# Altium project CurrentSensorV1.PrjPcb
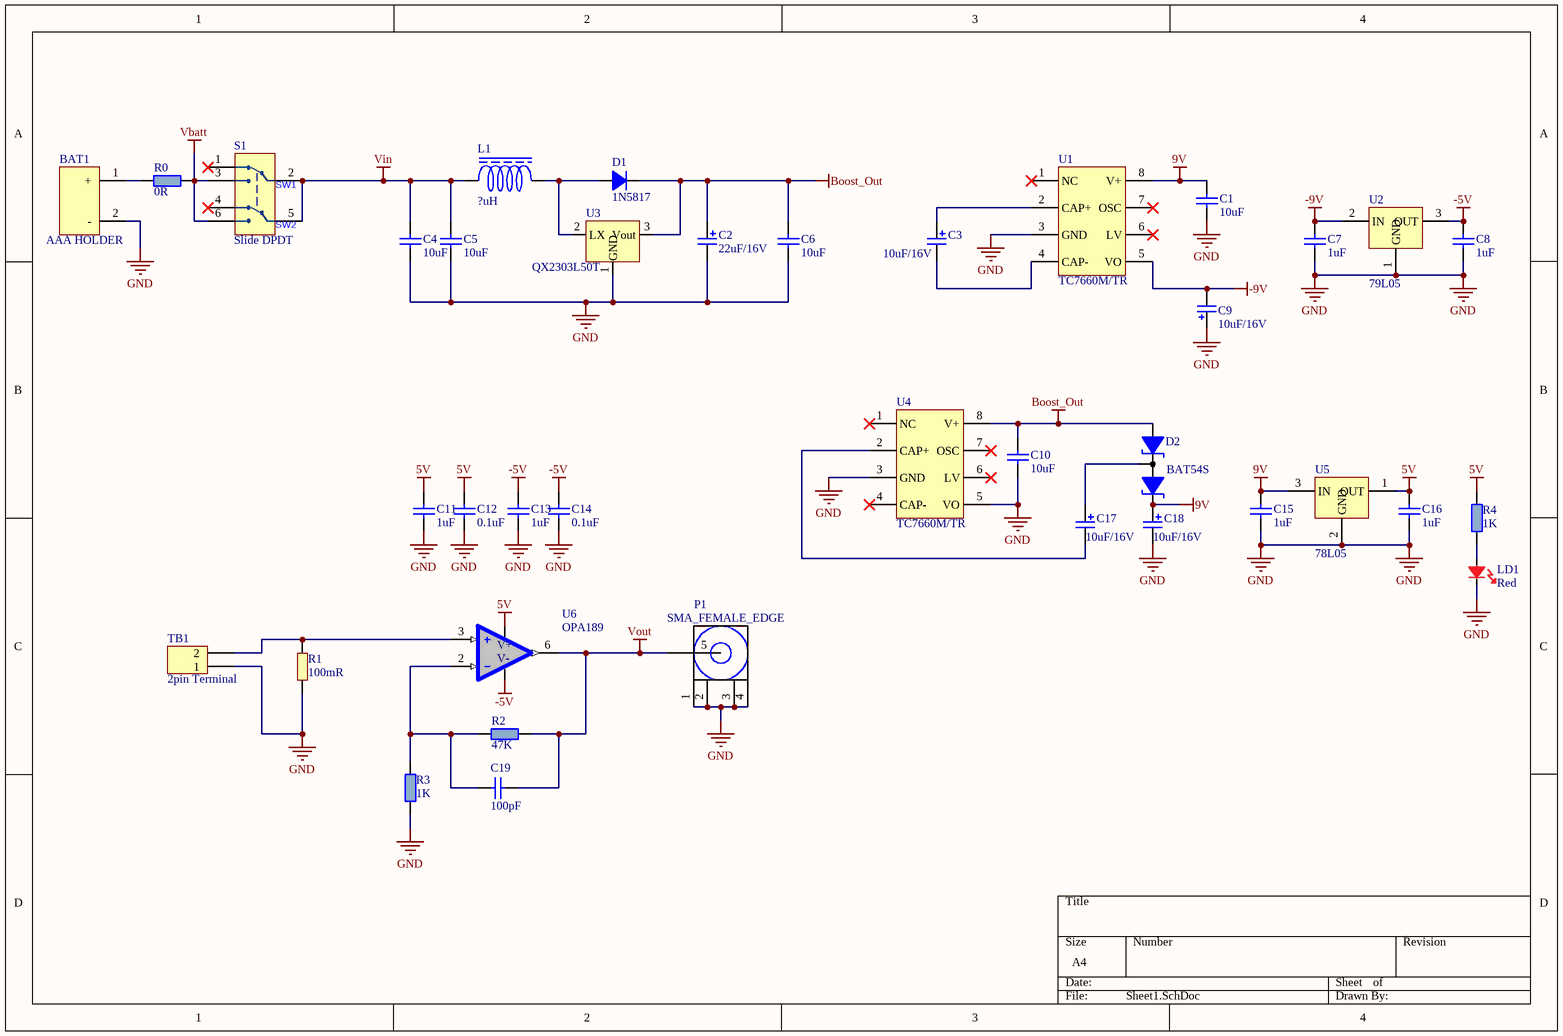
[diagram p0: Sheet1.SchDoc]
1 sheet, 38 parts. Net scope: global (net labels, ports and power ports of the same name join across sheets).
Board file: PCB1.PcbDoc

## Sheet Sheet1.SchDoc
size A4

### Parts
BAT1  AAA HOLDER  [AAA Battery Holder]
C1  10uF  [0805_CAP]
C2  22uF/16V  [CASEB_EIA3528-21]
C3  10uF/16V  [CASEA_EIA3216-18]
C4  10uF  [0805_CAP]
C5  10uF  [0805_CAP]
C6  10uF  [0805_CAP]
C7  1uF  [0805_CAP]
C8  1uF  [0805_CAP]
C9  10uF/16V  [CASEA_EIA3216-18]
C10  10uF  [0805_CAP]
C11  1uF  [0805_CAP]
C12  0.1uF  [0805_CAP]
C13  1uF  [0805_CAP]
C14  0.1uF  [0805_CAP]
C15  1uF  [0805_CAP]
C16  1uF  [0805_CAP]
C17  10uF/16V  [CASEA_EIA3216-18]
C18  10uF/16V  [CASEA_EIA3216-18]
C19  100pF  [0805_CAP]
D1  1N5817  [SOD123]
D2  BAT54S  [SOT23]
L1  ?uH  [IND_40x45x3.2]
LD1  Red  [LED0805_Red]
P1  SMA_FEMALE_EDGE  [SMA_EDGE_CONNECTOR]
R0  0R  [0805_res]
R1  100mR  [2512-1.8]
R2  47K  [0805_res]
R3  1K  [0805_res]
R4  1K  [0805_res]
S1  Slide DPDT  [SW_DPDT_SMD]
TB1  2pin Terminal  [TB_SCW_5mm_2way_Horz_TE101]
U1  TC7660M/TR  [SO8]
U2  79L05  [SOT89]
U3  QX2303L50T  [SOT23]
U4  TC7660M/TR  [SO8]
U5  78L05  [SOT89]
U6  OPA189  [SO8]

### Nets
5V: C11.2 C12.2 C16.2 R4.2 U5.1(OUT) U6.7(V+)
9V: C1.2 C15.2 C18.1(A) D2.2(K2) U1.8(V+) U5.3(IN)
-5V: C8.2 C13.2 C14.2 U2.3(OUT) U6.4(V-)
-9V: C7.2 C9.2(K) U1.5(VO) U2.2(IN)
Boost_Out: C2.1(A) C6.2 C10.2 D1.2(K) D2.1(A1) U3.3(Vout) U4.8(V+)
GND: BAT1.2(-) C1.1 C2.2(K) C4.1 C5.1 C6.1 C7.1 C8.1 C9.1(A) C10.1 C11.1 C12.1 C13.1 C14.1 C15.1 C16.1 C18.2(K) LD1.2(K) P1.1 P1.2 P1.3 P1.4 R1.1 R3.1 TB1.1 U1.3(GND) U2.1(GND) U3.1(GND) U4.3(GND) U4.5(VO) U5.2(GND)
Vbatt: R0.1 S1.3(NO1) S1.6(NO2)
Vin: C4.2 C5.2 L1.1 S1.2(C1) S1.5(C2)
Vout: C19.1 P1.5 R2.2 U6.6(OUT)
NetBAT1_1: BAT1.1(+) R0.2
NetC3_1: C3.1(A) U1.2(CAP+)
NetC3_2: C3.2(K) U1.4(CAP-)
NetC17_1: C17.1(A) D2.3(S)
NetC17_2: C17.2(K) U4.2(CAP+)
NetC19_2: C19.2 R2.1 R3.2 U6.2(IN-)
NetD1_1: D1.1(A) L1.2 U3.2(LX)
NetLD1_1: LD1.1(A) R4.1
NetR1_2: R1.2 TB1.2 U6.3(IN+)

Not connected (* = marked no-connect by the designer): S1 1(NC1)* 4(NC2)*; U1 1(NC)* 6(LV)* 7(OSC)*; U4 1(NC)* 4(CAP-)* 6(LV)* 7(OSC)*

### Notes on the sheet
- (in symbol SW_Slide_DPDT) SW1; SW2

### Library data of the parts
BAT1 = BATT_HOLDER_AAA: LCSC#: C5290189 / Mfr.#: BH-AAA-A1AJ001 / Mfr: MYOUNG / Battery case No 7 - Battery Connectors ROHS
C1 C4-C8 C10-C16 C19 = CC_?F_0805: Capacitor, Ceramic,, ?F, ?V, 0805; Manufacturer: Murata; Notes: Capacitor, Ceramic, 2.2uF, 16V, Y5V, 0805; Mfg_PN: GRM21BF51C225ZA01L; Engineer’s Name: WZ; Category: Cap - Ceramic; Supplier 2: RS Components; Supplier Part Number 2: 312-3156; Date Updated: 1 July 2014; Verified: Correct desc from 50v to 16v
C2 = CT_22uF_16V_3528: / LCSC#: C122226 / Mfr.#: CA45-B016K226T / Mfr: Hunan Xiangyee in S&T / 22uF 16V 2.2Ω@100kHz ±10% CASE-B-3528 Tantalum Capacitors ROHS
C3 C9 C17 C18 = CT_10uF_16V_3216: LCSC#: C119051 / Mfr.#: CA45-A016K106T / Mfr: Hunan Xiangyee in S&T / 10uF 16V 3Ω@100kHz ±10% CASE-A-3216 Tantalum Capacitors ROHS
D1 = DI_1N5817: LCSC#: C5185908 / Mfr.#: 1N5817W / Mfr: Slkor(SLKORMICRO Elec.) / SOD-123 Schottky Barrier Diodes (SBD) ROHS
D2 = DI_BAT54S: LCSC#: C2762214 / Mfr.#: BAT54S / Mfr: Shandong Jingdao Microelectronics / 30V Dual 1V@100mA 0.2A SOT-23 Schottky Barrier Diodes (SBD) ROHS
L1 = IND_?uH_4045: LCSC#: C2929422 / Mfr.#: CY43-47UH / Mfr: SHOU HAN / 400mA 47uH ±10% 525mΩ SMD,4x4.5mm Inductors (SMD) ROHS
LD1 = LED_RED230mcd_2013: LED, Red, 2.0V, Imax 30mA, 120deg. At 20mA => Wavelength = 630nm, 230mcd, 0805; Manufacturer: Kingbright; Mfg_PN: KPT-2012SURCK; Used_for: Alarm; Category: Diode - LED; URL: http://www.farnell.com/datasheets/1753997.pdf; Supplier 2: Farnell; Supplier Part Number 2: 2099241
P1 = CONN_SMA_RF_EDGE: SMA FEMALE Edge Connector
R0 R2-R4 = RS_?R_0805: Resistor, ?ohm, 0805; Manufacturer: MULTICOMP; Notes: Resistor, 10k 100mW 1%, 0805; Mfg_PN: MC0.1W08051%10KFR; Category: Resistor; Supplier 2: Element14; Supplier Part Number 2: 2129195; Supplier 3: Digikey; Supplier Part Number 3: 311-10.0KCRCT-ND
R1 = RS_?R_2512: 2512 Resistor
S1 = SW_Slide_DPDT: LCSC#: C2906280 / Mfr.#: MST22D18G2 125 / Mfr: SHOU HAN / Brick nogging 0.1A DPDT 12V Black 10000次 SMD Slide Switches ROHS
TB1 = TE101_2W_5mm: Screw Terminal Block 5mm Pitch 2 Position, Green; Manufacturer: Dinkle; Notes: Replacable with Altronics P2034A; Mfg_PN: EK500V-02P; Supplier 1: Brooks; Category: Connector; Supplier Part Number 1: TE101; Supplier 2: Element 14; Supplier Part Number 2: 2293859; Supplier 4: ALTRONICS; Supplier Part Number 4: P 2034A; Supplier Part Number 3: 277-1258-ND; Supplier 3: Digikey
U1 U4 = IC_TC7660M/TR: LCSC#: C512761 / Mfr.#: TC7660M/TR / Mfr: HGSEMI / SOP-8 Charge Pump
U2 = LDO_79L05: LCSC#: C7543011 / Mfr.#: 79L05 / Mfr: HXY MOSFET / 100mA null 5V Negative 35V SOT-89 Linear Voltage Regulators (LDO) ROHS
U3 = IC_PMIC_SW_QX2303L50T: LCSC#: C219027 / Mfr.#: QX2303L50T / Mfr: QX Micro Devices / boost converterType 5V 0.7V~5V 800mA SOT-23 DC-DC Converters ROHS
U5 = LDO_78L05: LCSC#: C2891830 / Mfr.#: 78L05 / Mfr: YONGYUTAI / 49dB@(120Hz) 0.1A Fixed 5V Positive 35V SOT-89-3 Linear Voltage Regulators (LDO) ROHS
U6 = IC_OP_OPA189IDR: LCSC#: C781811 / Mfr.#: OPA189IDR / Mfr: Texas Instruments / 14MHz 0.4uV 70pA Single 轨到轨 SOP-8 Precision OpAmps ROHS